# EAGLE schematic Mainland (EAGLE 9.2.0)
CNAME: plus12BLE; CREVISION: RevA; DESIGNER: Josh DeWitt

## Sheet 1 of 2
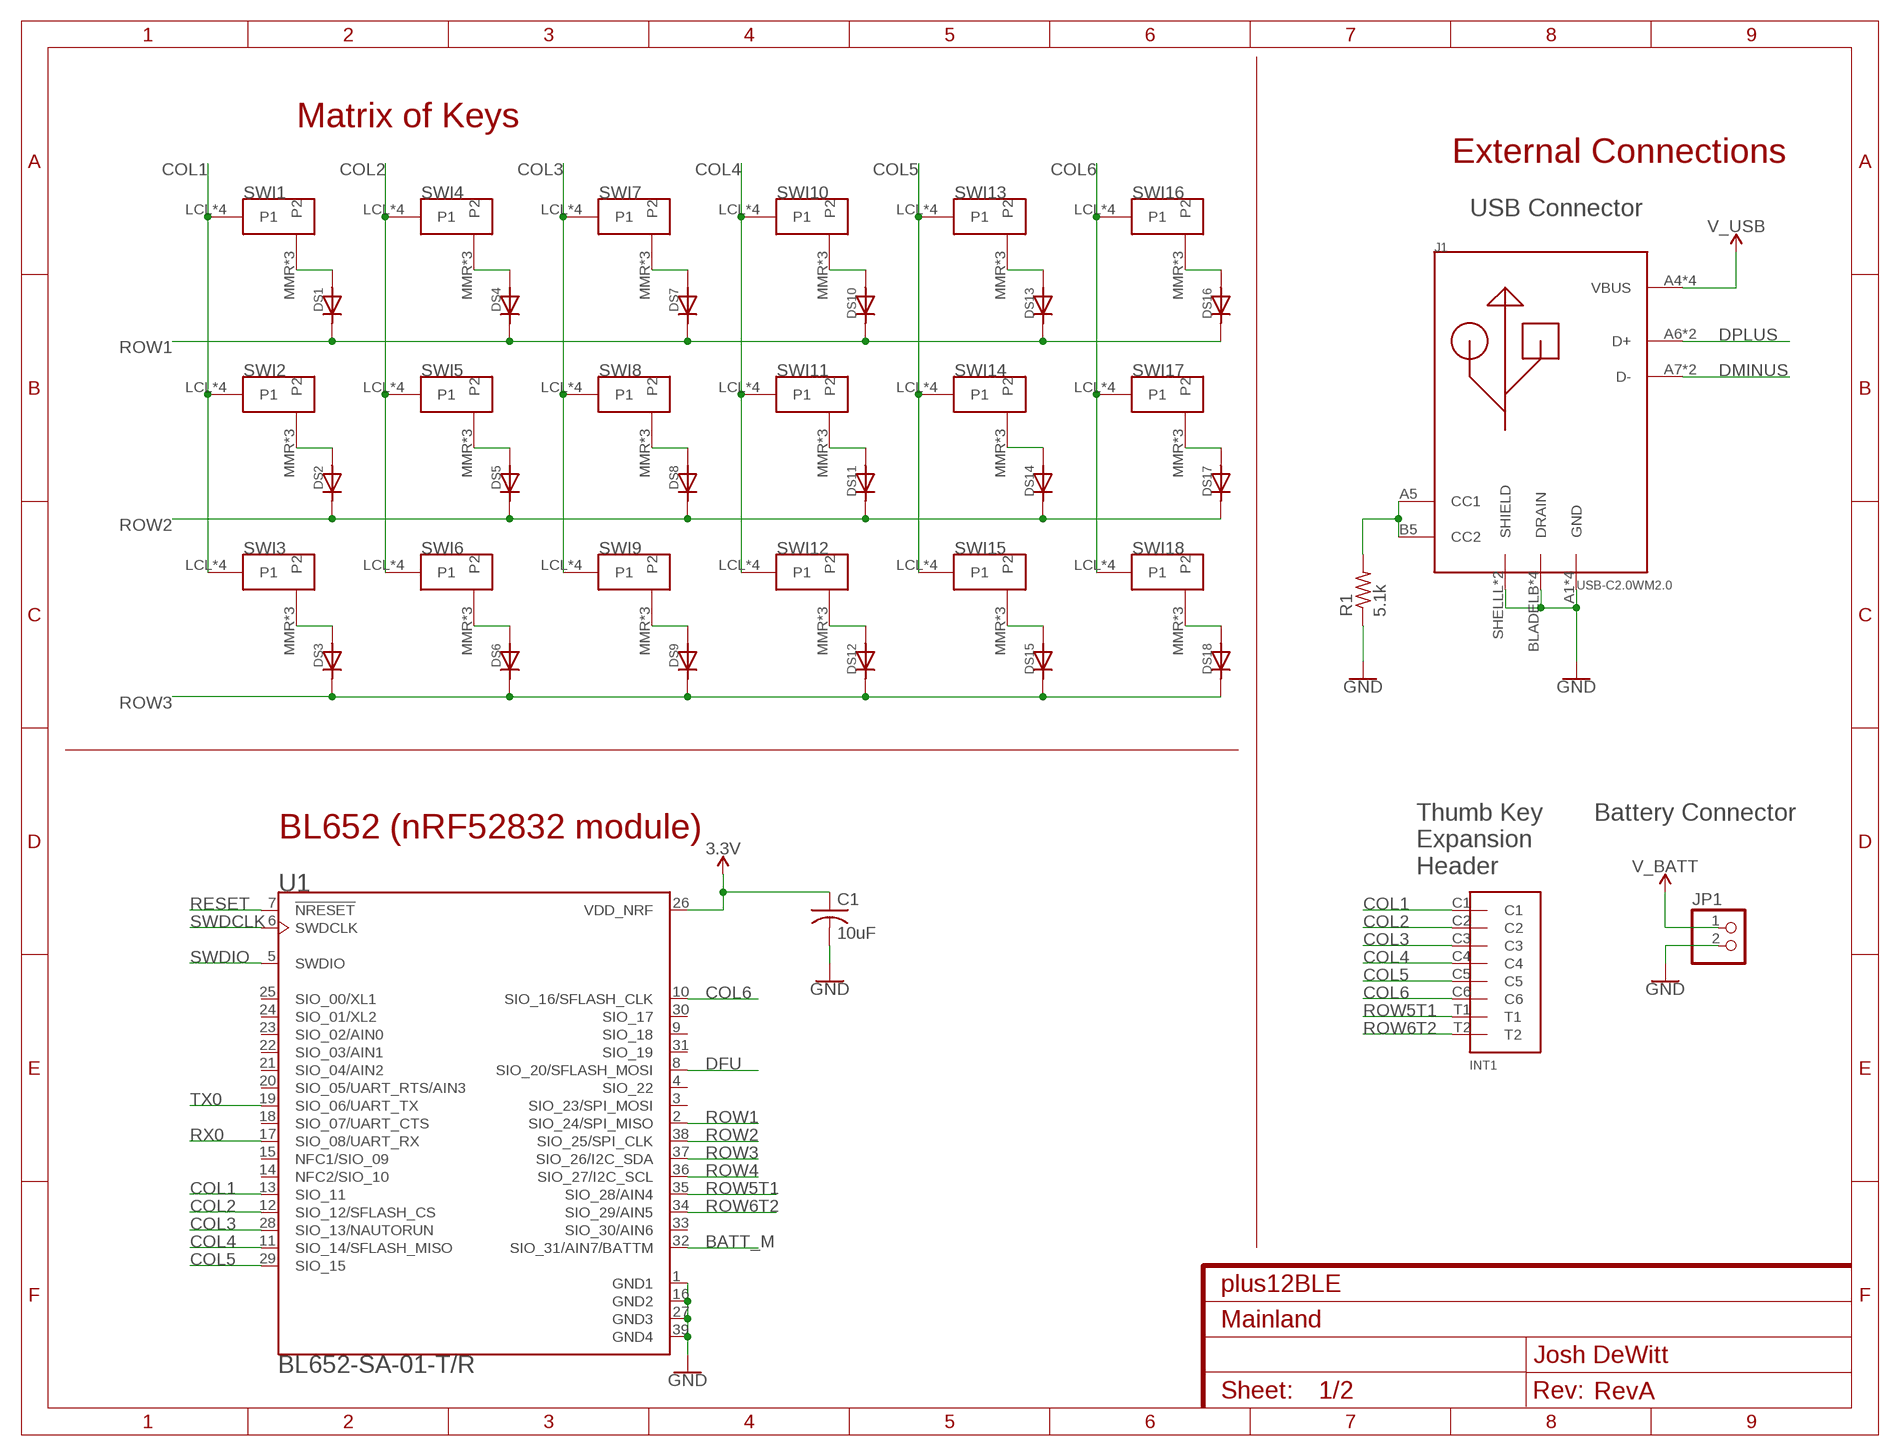
[diagram p0: schematic, sheet 1]

### Parts
C1  10uF  C-USC0805K  [C0805K]
DS1  DIODECOMBO  [DIODE_COMBO]
DS2  DIODECOMBO  [DIODE_COMBO]
DS3  DIODECOMBO  [DIODE_COMBO]
DS4  DIODECOMBO  [DIODE_COMBO]
DS5  DIODECOMBO  [DIODE_COMBO]
DS6  DIODECOMBO  [DIODE_COMBO]
DS7  DIODECOMBO  [DIODE_COMBO]
DS8  DIODECOMBO  [DIODE_COMBO]
DS9  DIODECOMBO  [DIODE_COMBO]
DS10  DIODECOMBO  [DIODE_COMBO]
DS11  DIODECOMBO  [DIODE_COMBO]
DS12  DIODECOMBO  [DIODE_COMBO]
DS13  DIODECOMBO  [DIODE_COMBO]
DS14  DIODECOMBO  [DIODE_COMBO]
DS15  DIODECOMBO  [DIODE_COMBO]
DS16  DIODECOMBO  [DIODE_COMBO]
DS17  DIODECOMBO  [DIODE_COMBO]
DS18  DIODECOMBO  [DIODE_COMBO]
FRAME1  FRAME_LTR_CU_MARK  [FR-LTR-ON-PCB]
INT1  INTRCNNT4X2  [INTRRIBBON]
J1  USB-C2.0WM2.0  [WM17904_SIMP]
JP1  PINHD-1X2  [1X02]
R1  5.1k  R-US_R0603  [R0603]
SWI1  MX/ALPSDOUBLE_SLOT  [DOUBLED_SLOTS]
SWI2  MX/ALPSDOUBLE_SLOT  [DOUBLED_SLOTS]
SWI3  MX/ALPSDOUBLE_SLOT  [DOUBLED_SLOTS]
SWI4  MX/ALPSDOUBLE_SLOT  [DOUBLED_SLOTS]
SWI5  MX/ALPSDOUBLE_SLOT  [DOUBLED_SLOTS]
SWI6  MX/ALPSDOUBLE_SLOT  [DOUBLED_SLOTS]
SWI7  MX/ALPSDOUBLE_SLOT  [DOUBLED_SLOTS]
SWI8  MX/ALPSDOUBLE_SLOT  [DOUBLED_SLOTS]
SWI9  MX/ALPSDOUBLE_SLOT  [DOUBLED_SLOTS]
SWI10  MX/ALPSDOUBLE_SLOT  [DOUBLED_SLOTS]
SWI11  MX/ALPSDOUBLE_SLOT  [DOUBLED_SLOTS]
SWI12  MX/ALPSDOUBLE_SLOT  [DOUBLED_SLOTS]
SWI13  MX/ALPSDOUBLE_SLOT  [DOUBLED_SLOTS]
SWI14  MX/ALPSDOUBLE_SLOT  [DOUBLED_SLOTS]
SWI15  MX/ALPSDOUBLE_SLOT  [DOUBLED_SLOTS]
SWI16  MX/ALPSDOUBLE_SLOT  [DOUBLED_SLOTS]
SWI17  MX/ALPSDOUBLE_SLOT  [DOUBLED_SLOTS]
SWI18  MX/ALPSDOUBLE_SLOT  [DOUBLED_SLOTS]
U1  BL652-SA-01-T/R  [XCVR_BL652-SA-01-T/R]

### Nets
3.3V: C1.1 U1.26(VDD_NRF) ; also sheet 2
BATT_M: U1.32(SIO_31/AIN7/BATTM) ; also sheet 2
COL1: INT1.C1 SWI1.LCL(P1) SWI1.LLP(P1) SWI1.LRLP(P1) SWI1.MML(P1) SWI2.LCL(P1) SWI2.LLP(P1) SWI2.LRLP(P1) SWI2.MML(P1) SWI3.LCL(P1) SWI3.LLP(P1) SWI3.LRLP(P1) SWI3.MML(P1) U1.13(SIO_11)
COL2: INT1.C2 SWI4.LCL(P1) SWI4.LLP(P1) SWI4.LRLP(P1) SWI4.MML(P1) SWI5.LCL(P1) SWI5.LLP(P1) SWI5.LRLP(P1) SWI5.MML(P1) SWI6.LCL(P1) SWI6.LLP(P1) SWI6.LRLP(P1) SWI6.MML(P1) U1.12(SIO_12/SFLASH_CS)
COL3: INT1.C3 SWI7.LCL(P1) SWI7.LLP(P1) SWI7.LRLP(P1) SWI7.MML(P1) SWI8.LCL(P1) SWI8.LLP(P1) SWI8.LRLP(P1) SWI8.MML(P1) SWI9.LCL(P1) SWI9.LLP(P1) SWI9.LRLP(P1) SWI9.MML(P1) U1.28(SIO_13/NAUTORUN)
COL4: INT1.C4 SWI10.LCL(P1) SWI10.LLP(P1) SWI10.LRLP(P1) SWI10.MML(P1) SWI11.LCL(P1) SWI11.LLP(P1) SWI11.LRLP(P1) SWI11.MML(P1) SWI12.LCL(P1) SWI12.LLP(P1) SWI12.LRLP(P1) SWI12.MML(P1) U1.11(SIO_14/SFLASH_MISO)
COL5: INT1.C5 SWI13.LCL(P1) SWI13.LLP(P1) SWI13.LRLP(P1) SWI13.MML(P1) SWI14.LCL(P1) SWI14.LLP(P1) SWI14.LRLP(P1) SWI14.MML(P1) SWI15.LCL(P1) SWI15.LLP(P1) SWI15.LRLP(P1) SWI15.MML(P1) U1.29(SIO_15)
COL6: INT1.C6 SWI16.LCL(P1) SWI16.LLP(P1) SWI16.LRLP(P1) SWI16.MML(P1) SWI17.LCL(P1) SWI17.LLP(P1) SWI17.LRLP(P1) SWI17.MML(P1) SWI18.LCL(P1) SWI18.LLP(P1) SWI18.LRLP(P1) SWI18.MML(P1) U1.10(SIO_16/SFLASH_CLK)
DFU: U1.8(SIO_20/SFLASH_MOSI) ; also sheet 2
DMINUS: J1.A7(D-) J1.B7(D-) ; also sheet 2
DPLUS: J1.A6(D+) J1.B6(D+) ; also sheet 2
GND: C1.2 J1.A1(GND) J1.A12(GND) J1.B1(GND) J1.B12(GND) J1.BLADELB(DRAIN) J1.BLADELF(DRAIN) J1.BLADERB(DRAIN) J1.BLADERF(DRAIN) J1.SHELLL(SHIELD) J1.SHELLR(SHIELD) JP1.2 R1.1 U1.1(GND1) U1.16(GND2) U1.27(GND3) U1.39(GND4) ; also sheet 2
N$1: DS1.ANOST(AN) DS1.ANOT(AN) SWI1.MMR(P2) SWI1.RCL(P2) SWI1.RLMID(P2)
N$2: DS4.ANOST(AN) DS4.ANOT(AN) SWI4.MMR(P2) SWI4.RCL(P2) SWI4.RLMID(P2)
N$3: DS7.ANOST(AN) DS7.ANOT(AN) SWI7.MMR(P2) SWI7.RCL(P2) SWI7.RLMID(P2)
N$4: DS10.ANOST(AN) DS10.ANOT(AN) SWI10.MMR(P2) SWI10.RCL(P2) SWI10.RLMID(P2)
N$5: DS13.ANOST(AN) DS13.ANOT(AN) SWI13.MMR(P2) SWI13.RCL(P2) SWI13.RLMID(P2)
N$6: DS16.ANOST(AN) DS16.ANOT(AN) SWI16.MMR(P2) SWI16.RCL(P2) SWI16.RLMID(P2)
N$7: DS2.ANOST(AN) DS2.ANOT(AN) SWI2.MMR(P2) SWI2.RCL(P2) SWI2.RLMID(P2)
N$8: DS5.ANOST(AN) DS5.ANOT(AN) SWI5.MMR(P2) SWI5.RCL(P2) SWI5.RLMID(P2)
N$9: DS8.ANOST(AN) DS8.ANOT(AN) SWI8.MMR(P2) SWI8.RCL(P2) SWI8.RLMID(P2)
N$10: DS11.ANOST(AN) DS11.ANOT(AN) SWI11.MMR(P2) SWI11.RCL(P2) SWI11.RLMID(P2)
N$11: DS14.ANOST(AN) DS14.ANOT(AN) SWI14.MMR(P2) SWI14.RCL(P2) SWI14.RLMID(P2)
N$12: DS17.ANOST(AN) DS17.ANOT(AN) SWI17.MMR(P2) SWI17.RCL(P2) SWI17.RLMID(P2)
N$13: DS3.ANOST(AN) DS3.ANOT(AN) SWI3.MMR(P2) SWI3.RCL(P2) SWI3.RLMID(P2)
N$14: DS6.ANOST(AN) DS6.ANOT(AN) SWI6.MMR(P2) SWI6.RCL(P2) SWI6.RLMID(P2)
N$15: DS9.ANOST(AN) DS9.ANOT(AN) SWI9.MMR(P2) SWI9.RCL(P2) SWI9.RLMID(P2)
N$16: DS12.ANOST(AN) DS12.ANOT(AN) SWI12.MMR(P2) SWI12.RCL(P2) SWI12.RLMID(P2)
N$17: DS15.ANOST(AN) DS15.ANOT(AN) SWI15.MMR(P2) SWI15.RCL(P2) SWI15.RLMID(P2)
N$18: DS18.ANOST(AN) DS18.ANOT(AN) SWI18.MMR(P2) SWI18.RCL(P2) SWI18.RLMID(P2)
N$20: J1.A5(CC1) J1.B5(CC2) R1.2
RESET: U1.7(!NRESET) ; also sheet 2
ROW1: DS1.CATST(CAT) DS1.CATT(CAT) DS4.CATST(CAT) DS4.CATT(CAT) DS7.CATST(CAT) DS7.CATT(CAT) DS10.CATST(CAT) DS10.CATT(CAT) DS13.CATST(CAT) DS13.CATT(CAT) DS16.CATST(CAT) DS16.CATT(CAT) U1.2(SIO_24/SPI_MISO)
ROW2: DS2.CATST(CAT) DS2.CATT(CAT) DS5.CATST(CAT) DS5.CATT(CAT) DS8.CATST(CAT) DS8.CATT(CAT) DS11.CATST(CAT) DS11.CATT(CAT) DS14.CATST(CAT) DS14.CATT(CAT) DS17.CATST(CAT) DS17.CATT(CAT) U1.38(SIO_25/SPI_CLK)
ROW3: DS3.CATST(CAT) DS3.CATT(CAT) DS6.CATST(CAT) DS6.CATT(CAT) DS9.CATST(CAT) DS9.CATT(CAT) DS12.CATST(CAT) DS12.CATT(CAT) DS15.CATST(CAT) DS15.CATT(CAT) DS18.CATST(CAT) DS18.CATT(CAT) U1.37(SIO_26/I2C_SDA)
ROW4: U1.36(SIO_27/I2C_SCL)
ROW5T1: INT1.T1 U1.35(SIO_28/AIN4)
ROW6T2: INT1.T2 U1.34(SIO_29/AIN5)
RX0: U1.17(SIO_08/UART_RX) ; also sheet 2
SWDCLK: U1.6(SWDCLK) ; also sheet 2
SWDIO: U1.5(SWDIO) ; also sheet 2
TX0: U1.19(SIO_06/UART_TX) ; also sheet 2
V_BATT: JP1.1 ; also sheet 2
V_USB: J1.A4(VBUS) J1.A9(VBUS) J1.B4(VBUS) J1.B9(VBUS) ; also sheet 2
Unconnected: U1.3(SIO_23/SPI_MOSI) U1.4(SIO_22) U1.9(SIO_18) U1.14(NFC2/SIO_10) U1.15(NFC1/SIO_09) U1.18(SIO_07/UART_CTS) U1.20(SIO_05/UART_RTS/AIN3) U1.21(SIO_04/AIN2) U1.22(SIO_03/AIN1) U1.23(SIO_02/AIN0) U1.24(SIO_01/XL2) U1.25(SIO_00/XL1) U1.30(SIO_17) U1.31(SIO_19) U1.33(SIO_30/AIN6)

### Notes on the sheet
- Matrix of Keys
- External Connections
- USB Connector
- Battery Connector
- BL652 (nRF52832 module)
- Thumb Key
  Expansion
  Header

## Sheet 2 of 2
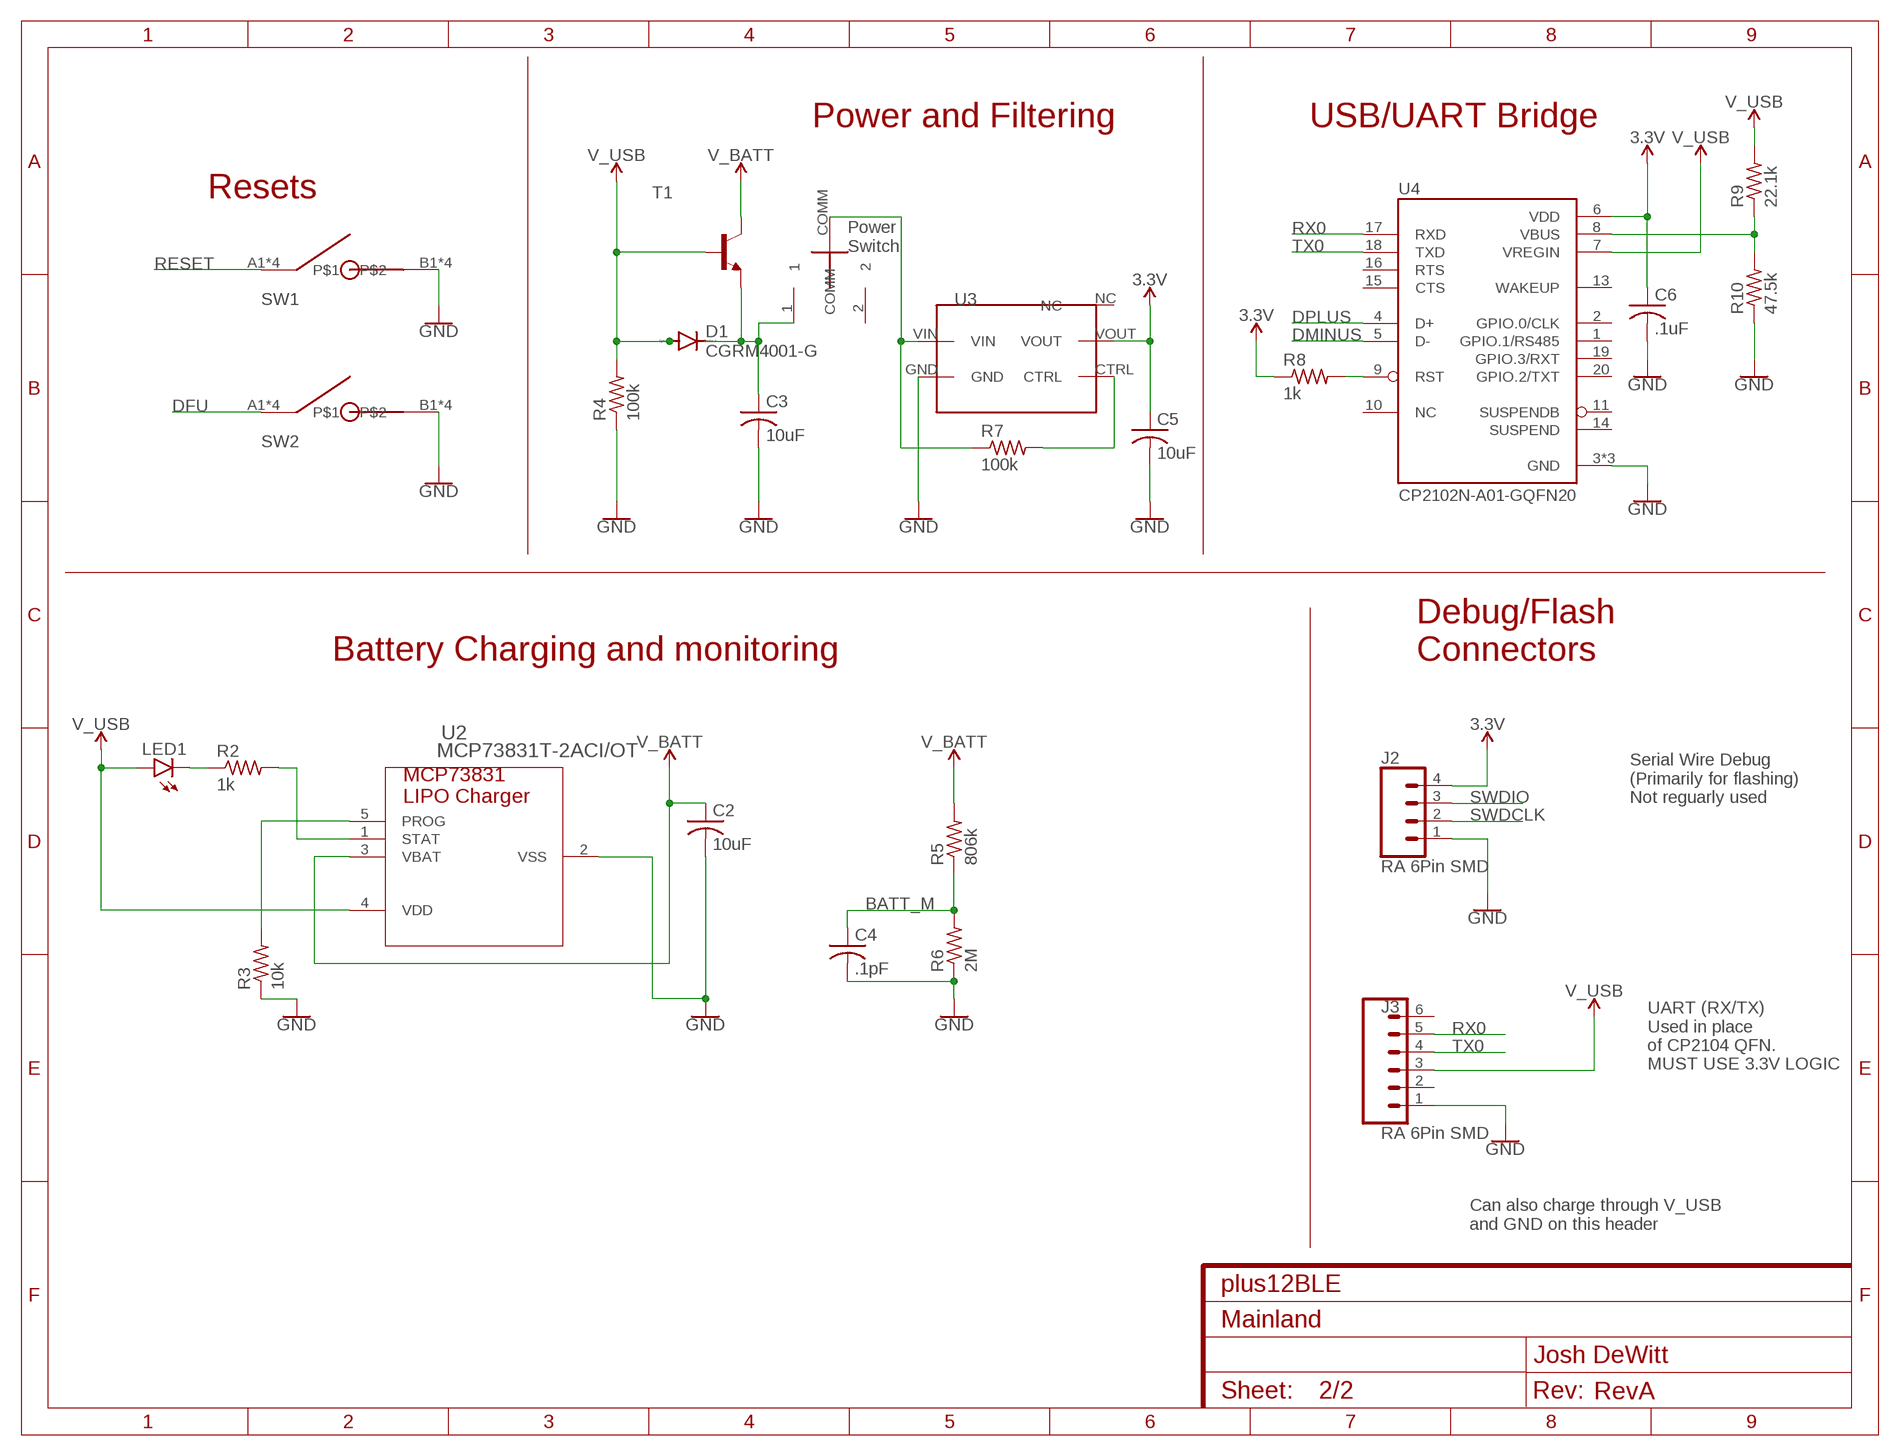
[diagram p1: schematic, sheet 2]

### Parts
C2  10uF  C-USC0805K  [C0805K]
C3  10uF  C-USC0805K  [C0805K]
C4  .1pF  C-USC0603  [C0603]
C5  10uF  C-USC0805K  [C0805K]
C6  .1uF  C-USC0603  [C0603]
D1  CGRM4001-G  [SOD-123_MINI-SMA]
FRAME2  FRAME_LTR_CU_MARK  [FR-LTR-ON-PCB]
J2  RA 6Pin SMD  CONN_04SMD_RA_FEMALE  [1X04_SMD_RA_FEMALE]
J3  RA 6Pin SMD  CONN_06SMD  [1X06-SMD_RA_MALE]
LED1  LEDCHIP-LED0603  [CHIP-LED0603]
R2  1k  R-US_R0603  [R0603]
R3  10k  R-US_R0603  [R0603]
R4  100k  R-US_R0603  [R0603]
R5  806k  R-US_R0603  [R0603]
R6  2M  R-US_R0603  [R0603]
R7  100k  R-US_R0603  [R0603]
R8  1k  R-US_R0603  [R0603]
R9  22.1k  R-US_R0603  [R0603]
R10  47.5k  R-US_R0603  [R0603]
SW1  RSTSWSMALL_SMD  [EVP-BBA]
SW2  RSTSWSMALL_SMD  [EVP-BBA]
SW3  SLIDER_SWITCH  [MHSS1105]
T1  BC808-NPN-SOT23-BEC  [SOT23-BEC]
U2  MCP73831T-2ACI/OT  [SOT-23-5_MC]
U3  TCR2EF  [TCR2EF]
U4  CP2102N-A01-GQFN20  [SILABS_QFN20]

### Nets
3.3V: C5.1 C6.1 J2.4 R8.1 U3.VOUT U4.6(VDD) ; also sheet 1
BATT_M: C4.1 R5.1 R6.2 ; also sheet 1
DFU: SW2.A1 SW2.A2 SW2.A3 SW2.A4 ; also sheet 1
DMINUS: U4.5(D-) ; also sheet 1
DPLUS: U4.4(D+) ; also sheet 1
GND: C2.2 C3.2 C4.2 C5.2 C6.2 J2.1 J3.1 R3.1 R4.1 R6.1 R10.1 SW1.B1 SW1.B2 SW1.B3 SW1.B4 SW2.B1 SW2.B2 SW2.B3 SW2.B4 U2.2(VSS) U3.GND U4.3(GND) U4.12(GND) U4.21(GND) ; also sheet 1
N$19: R7.2 U3.CTRL
N$21: R7.1 SW3.COMM U3.VIN
N$22: LED1.C R2.1
N$23: R2.2 U2.1(STAT)
N$24: R3.2 U2.5(PROG)
N$25: R9.1 R10.2 U4.8(VBUS)
N$26: R8.2 U4.9(RST)
N$27: C3.1 D1.C SW3.1 T1.E
RESET: SW1.A1 SW1.A2 SW1.A3 SW1.A4 ; also sheet 1
RX0: J3.5 U4.17(RXD) ; also sheet 1
SWDCLK: J2.2 ; also sheet 1
SWDIO: J2.3 ; also sheet 1
TX0: J3.4 U4.18(TXD) ; also sheet 1
V_BATT: C2.1 R5.2 T1.C U2.3(VBAT) ; also sheet 1
V_USB: D1.A J3.3 LED1.A R4.2 R9.2 T1.B U2.4(VDD) U4.7(VREGIN) ; also sheet 1
Unconnected: J3.2 J3.6 SW3.2 U3.NC U4.1(GPIO.1/RS485) U4.2(GPIO.0/CLK) U4.10(NC) U4.11(SUSPENDB) U4.13(WAKEUP) U4.14(SUSPEND) U4.15(CTS) U4.16(RTS) U4.19(GPIO.3/RXT) U4.20(GPIO.2/TXT)

### Notes on the sheet
- Power and Filtering | USB/UART Bridge
- Resets
- Power
  Switch
- Battery Charging and monitoring
- Debug/Flash
  Connectors
- Serial Wire Debug
  (Primarily for flashing)
  Not reguarly used
- UART (RX/TX)
  Used in place
  of CP2104 QFN.
  MUST USE 3.3V LOGIC
- Can also charge through V_USB
  and GND on this header

## Library data of the parts
C1-C6 = resistor:C-US: CAPACITOR, American symbol
D1 = diode:CGRM400*-G: Molded plasitc,JEDEC SOD-123/Mini SMA Source: Comchip CGRM4001-G.pdf
DS1-DS18 = Keys:DIODE
FRAME1 FRAME2 = ProperFrame:FRAME_LTR_CU_MARK: Frame sized for 8.5x11" page with 0.25" margin. Places name, datecode and revision mark in bottom copper layer of PCB.
INT1 = Keys:INTRCNNT
J1 = Keys:USB-C2.0
J2 = SparkFun-Connectors:CONN_04: Multi connection point. Often used as Generic Header-pin footprint for 0.1 inch spaced/style header connections On any of the 0.1 inch spaced packages, you can populate with these: Break Away Headers - Straight <https://www.sparkfun.com/products/116> (PRT-00116) Break Away Male Headers - Right Angle <https://www.sparkfun.com/products/553> (PRT-00553) Female Headers <https://www.sparkfun.com/products/115> (PRT-00115) Break Away Headers - Machine Pin <https://www.sparkfun.com/products/117> (PRT-00117) Break Away Female Headers - Swiss Machine Pin <https://www.sparkfun.com/products/743> (PRT-00743) For SCREWTERMINALS and SPRING TERMINALS visit here: Screw Terimnals on SparkFun.com <https://www.sparkfun.com/search/results?term=Screw+Terminals> (5mm/3.5mm/2.54mm spacing) This device is also useful as a general connection point to wire up your design to another part of your project. Our various solder wires solder well into these plated through hole pads. Hook-Up Wire - Assortment (Stranded, 22 AWG) <https://www.sparkfun.com/products/11375> (PRT-11375) Hook-Up Wire - Assortment (Solid Core, 22 AWG) <https://www.sparkfun.com/products/11367> (PRT-11367) View the entire wire category on our website here <https://www.sparkfun.com/categories/141> Special notes: Molex polarized connector foot print use with SKU : PRT-08231 with associated crimp pins and housings. 1MM SMD Version SKU: PRT-10208; PROD_ID: CONN-12382
J3 = SparkFun-Connectors:CONN_06: Multi connection point. Often used as Generic Header-pin footprint for 0.1 inch spaced/style header connections On any of the 0.1 inch spaced packages, you can populate with these: Break Away Headers - Straight <https://www.sparkfun.com/products/116> (PRT-00116) Break Away Male Headers - Right Angle <https://www.sparkfun.com/products/553> (PRT-00553) Female Headers <https://www.sparkfun.com/products/115> (PRT-00115) Break Away Headers - Machine Pin <https://www.sparkfun.com/products/117> (PRT-00117) Break Away Female Headers - Swiss Machine Pin <https://www.sparkfun.com/products/743> (PRT-00743) Arduino Stackable Header - 6 Pin <https://www.sparkfun.com/products/9280> (PRT-09280) For SCREWTERMINALS and SPRING TERMINALS visit here: Screw Terimnals on SparkFun.com <https://www.sparkfun.com/search/results?term=Screw+Terminals> (5mm/3.5mm/2.54mm spacing) This device is also useful as a general connection point to wire up your design to another part of your project. Our various solder wires solder well into these plated through hole pads. Hook-Up Wire - Assortment (Stranded, 22 AWG) <https://www.sparkfun.com/products/11375> (PRT-11375) Hook-Up Wire - Assortment (Solid Core, 22 AWG) <https://www.sparkfun.com/products/11367> (PRT-11367) View the entire wire category on our website here <https://www.sparkfun.com/categories/141>; PROD_ID: CONN-08971
JP1 = pinhead:PINHD-1X2: PIN HEADER
LED1 = led:LED: LED OSRAM: - CHIPLED LG R971, LG N971, LY N971, LG Q971, LY Q971, LO R971, LY R971 LH N974, LH R974 LS Q976, LO Q976, LY Q976 LO Q996 - Hyper CHIPLED LW Q18S LB Q993, LB Q99A, LB R99A - SideLED LS A670, LO A670, LY A670, LG A670, LP A670 LB A673, LV A673, LT A673, LW A673 LH A674 LY A675 LS A676, LA A676, LO A676, LY A676, LW A676 LS A679, LY A679, LG A679 - Hyper Micro SIDELED® LS Y876, LA Y876, LO Y876, LY Y876 LT Y87S - SmartLED LW L88C, LW L88S LB L89C, LB L89S, LG L890 LS L89K, LO L89K, LY L89K LS L896, LA L896, LO L896, LY L896 - TOPLED LS T670, LO T670, LY T670, LG T670, LP T670 LSG T670, LSP T670, LSY T670, LOP T670, LYG T670 LG T671, LOG T671, LSG T671 LB T673, LV T673, LT T673, LW T673 LH T674 LS T676, LA T676, LO T676, LY T676, LB T676, LH T676, LSB T676, LW T676 LB T67C, LV T67C, LT T67C, LS T67K, LO T67K, LY T67K, LW E67C LS E67B, LA E67B, LO E67B, LY E67B, LB E67C, LV E67C, LT E67C LW T67C LS T679, LY T679, LG T679 LS T770, LO T770, LY T770, LG T770, LP T770 LB T773, LV T773, LT T773, LW T773 LH T774 LS E675, LA E675, LY E675, LS T675 LS T776, LA T776, LO T776, LY T776, LB T776 LHGB T686 LT T68C, LB T68C - Hyper Mini TOPLED® LB M676 - Mini TOPLED Santana® LG M470 LS M47K, LO M47K, LY M47K Source: http://www.osram.convergy.de LUXEON: - LUMILED® LXK2-PW12-R00, LXK2-PW12-S00, LXK2-PW14-U00, LXK2-PW14-V00 LXK2-PM12-R00, LXK2-PM12-S00, LXK2-PM14-U00 LXK2-PE12-Q00, LXK2-PE12-R00, LXK2-PE12-S00, LXK2-PE14-T00, LXK2-PE14-U00 LXK2-PB12-K00, LXK2-PB12-L00, LXK2-PB12-M00, LXK2-PB14-N00, LXK2-PB14-P00, LXK2-PB14-Q00 LXK2-PR12-L00, LXK2-PR12-M00, LXK2-PR14-Q00, LXK2-PR14-R00 LXK2-PD12-Q00, LXK2-PD12-R00, LXK2-PD12-S00 LXK2-PH12-R00, LXK2-PH12-S00 LXK2-PL12-P00, LXK2-PL12-Q00, LXK2-PL12-R00 Source: www.luxeon.com KINGBRIGHT: KA-3528ASYC Source: www.kingbright.com
R1-R10 = resistor:R-US_: RESISTOR, American symbol
SW1 SW2 = Keys:RSTSW
SW3 = Keys:SLIDER_SWITCH
SWI1-SWI18 = Keys:MX/ALPS
T1 = transistor:*-NPN-: NPN Transistror BF959 corrected 2008.03.06
U1 = BL652-SA-01-T_R:BL652-SA-01-T/R: Bluetooth v4.2 Module with NFC (Integrated Antenna); DESCRIPTION: Bluetooth 1.8V to 3.6V 1Mbps 39-Pin SMD Module T/R; DIGI-KEY_PART_NUMBER: BL652-SA-01-CT-ND; DIGI-KEY_PURCHASE_URL: https://www.digikey.com/product-detail/en/laird-wireless-thermal-systems/BL652-SA-01-T-R/BL652-SA-01-CT-ND/6181738?utm_source=snapeda&utm_medium=aggregator&utm_campaign=symbol; MF: Laird -; MP: BL652-SA-01-T/R; PACKAGE: SMD-39 Laird
U2 = MCP73831:MCP73831T-2ACI/OT; MANUFACTURER_PART_NUMBER: MCP73831T2ACIOT; VENDOR: Microchip
U3 = Keys:TCR2EF
U4 = CP2102N-A01-GQFN20:CP2102N-A01-GQFN20: Ic Bridge Usb To Uart 20qfn; DESCRIPTION: Usb-Uart Interface Bridge, Qfn-20; DIGI-KEY_PART_NUMBER: 336-3692-ND; DIGI-KEY_PURCHASE_URL: https://www.digikey.com/product-detail/en/silicon-labs/CP2102N-A01-GQFN20/336-3692-ND/6012517?utm_source=snapeda&utm_medium=aggregator&utm_campaign=symbol; MF: Silicon Labs; MP: CP2102N-A01-GQFN20; PACKAGE: QFN-20 Silicon Labs

## Net classes
1 Power: width 0.254 mm